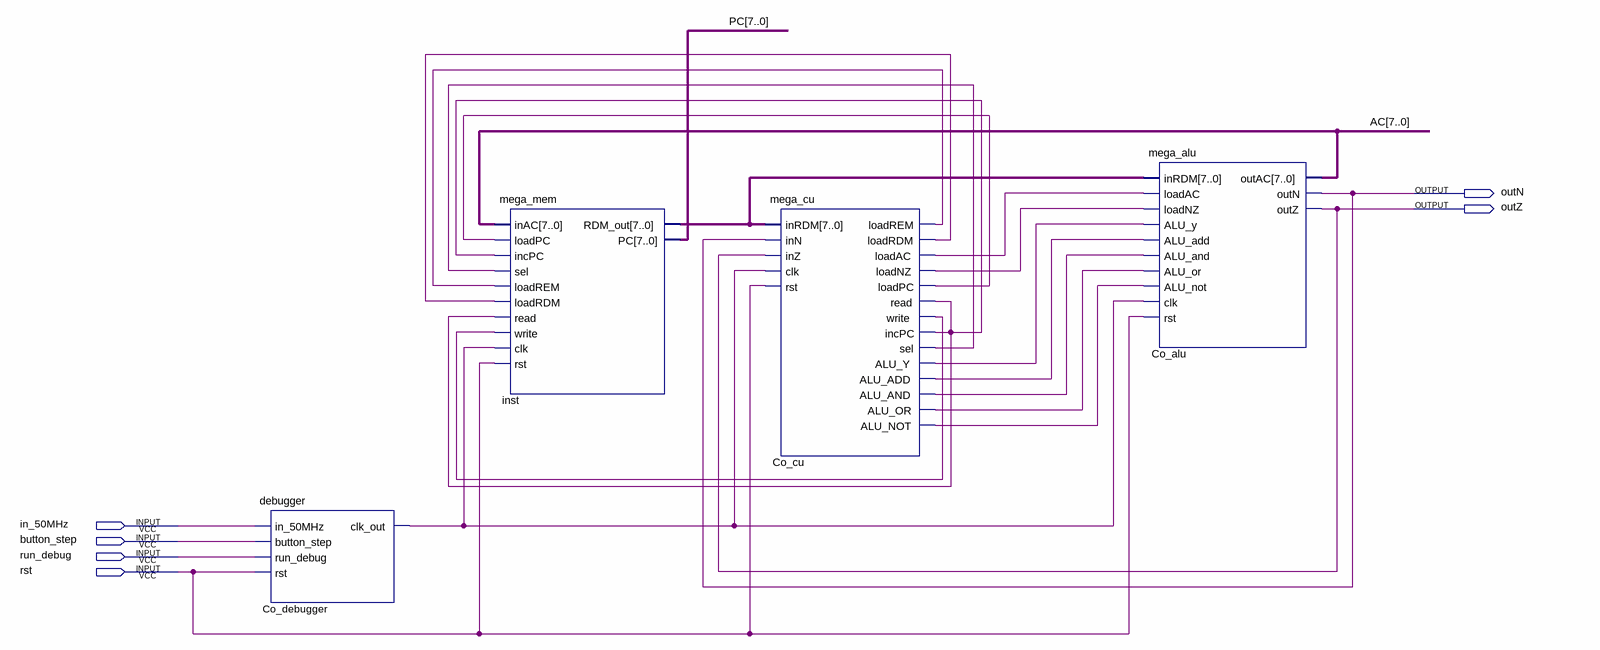
[diagram p0: schematic sheet]
// Quartus schematic test_neander.bdf as structural Verilog: 4 symbols, 6 pins
module test_neander (
  input  in_50MHz,
  input  button_step,
  input  run_debug,
  input  rst,
  output outN,
  output outZ
);

  wire Co_cu_alu_add, Co_cu_alu_and, Co_cu_alu_not, Co_cu_alu_or, Co_cu_alu_y, Co_cu_loadac, Co_cu_loadnz,
       Co_cu_loadpc, Co_cu_loadrdm, Co_cu_loadrem, Co_cu_read, Co_cu_sel, Co_cu_write, Co_debugger_clk_out;
  wire [7:0] AC, inst_rdm_out, PC;

  debugger Co_debugger (
    .in_50MHz(in_50MHz), .button_step(button_step), .run_debug(run_debug), .rst(rst),
    .clk_out(Co_debugger_clk_out));
  mega_mem inst (
    .inAC(AC), .loadPC(Co_cu_loadpc), .incPC(Co_cu_read), .sel(Co_cu_sel), .loadREM(Co_cu_loadrem),
    .loadRDM(Co_cu_loadrdm), .read(Co_cu_read), .write(Co_cu_write), .clk(Co_debugger_clk_out), .rst(rst),
    .RDM_out(inst_rdm_out), .PC(PC));
  mega_cu Co_cu (
    .inRDM(inst_rdm_out), .inN(outN), .inZ(outZ), .clk(Co_debugger_clk_out), .rst(rst),
    .loadREM(Co_cu_loadrem), .loadRDM(Co_cu_loadrdm), .loadAC(Co_cu_loadac), .loadNZ(Co_cu_loadnz),
    .loadPC(Co_cu_loadpc), .read(Co_cu_read), .write(Co_cu_write), .incPC(Co_cu_read), .sel(Co_cu_sel),
    .ALU_Y(Co_cu_alu_y), .ALU_ADD(Co_cu_alu_add), .ALU_AND(Co_cu_alu_and), .ALU_OR(Co_cu_alu_or),
    .ALU_NOT(Co_cu_alu_not));
  mega_alu Co_alu (
    .inRDM(inst_rdm_out), .loadAC(Co_cu_loadac), .loadNZ(Co_cu_loadnz), .ALU_y(Co_cu_alu_y),
    .ALU_add(Co_cu_alu_add), .ALU_and(Co_cu_alu_and), .ALU_or(Co_cu_alu_or), .ALU_not(Co_cu_alu_not),
    .clk(Co_debugger_clk_out), .rst(rst), .outAC(AC), .outN(outN), .outZ(outZ));
endmodule
